# Altium schematic sheet OMD_UWB.SchDoc
size A4; Organization: Altium Limited; Address1: L3, 12a Rodborough Rd; Address2: Frenchs Forest; Address3: NSW; Address4: Australia 2086
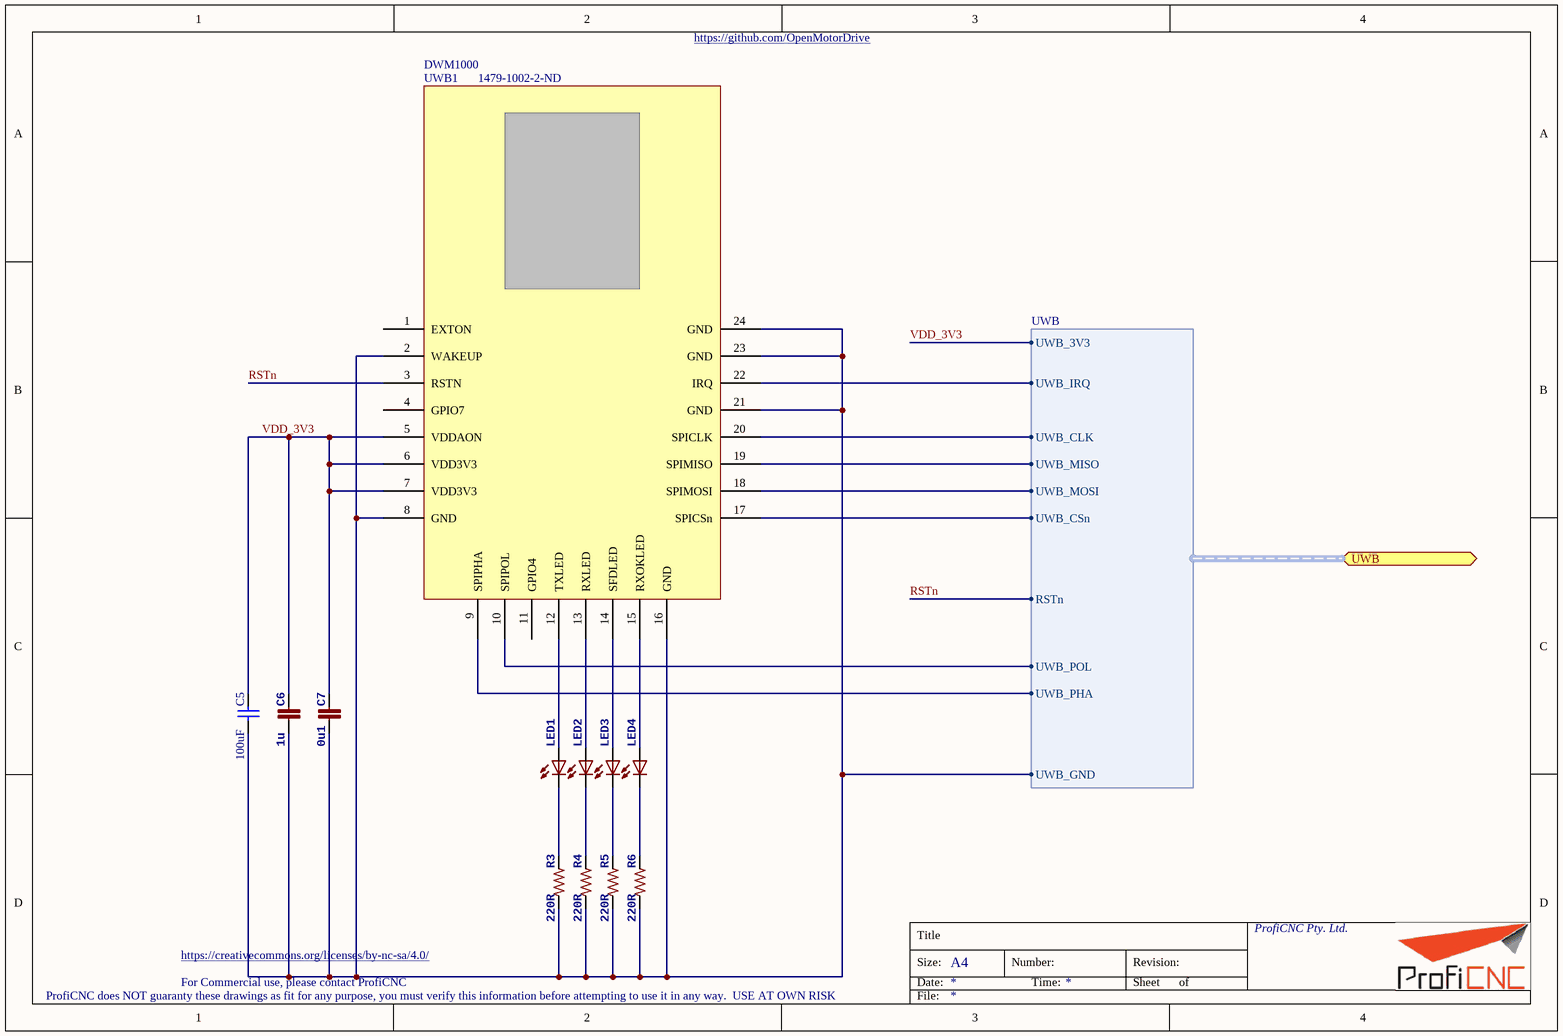
[diagram p0: OMD_UWB.SchDoc]

## Parts
C5  value 100uF  [C0805]  (hidden comment: GRM21BR60G107ME15L)
C6  1u  [0201-cap]
C7  0u1  [0201-cap]
LED1  AMBER  [0603-LED]  (value not drawn)
LED2  AMBER  [0603-LED]  (value not drawn)
LED3  AMBER  [0603-LED]  (value not drawn)
LED4  AMBER  [0603-LED]  (value not drawn)
R3  220R  [0402-RES]
R4  220R  [0402-RES]
R5  220R  [0402-RES]
R6  220R  [0402-RES]
UWB1  DWM1000  Supplier Part Number 1: 1479-1002-2-ND  [DWM1000]

## Ports
UWB (harness UWB)

## Harnesses
UWB: UWB_IRQ, UWB_CLK, UWB_MISO, UWB_MOSI, UWB_CSn, UWB_POL, UWB_PHA, UWB_GND, UWB_3V3, RSTn

## Nets
RSTn: UWB1.3(RSTN) ; port UWB.RSTn
VDD_3V3: C5.2 C6.1 C7.1 UWB1.5(VDDAON) UWB1.6(VDD3V3) UWB1.7(VDD3V3) ; port UWB.UWB_3V3
NetC5_1: C5.1 C6.2 C7.2 R3.1 R4.1 R5.1 R6.1 UWB1.2(WAKEUP) UWB1.8(GND) UWB1.16(GND) UWB1.21(GND) UWB1.23(GND) UWB1.24(GND) ; port UWB.UWB_GND
NetLED1_A: LED1.A UWB1.12(TXLED)
NetLED1_C: LED1.C R3.2
NetLED2_A: LED2.A UWB1.13(RXLED)
NetLED2_C: LED2.C R4.2
NetLED3_A: LED3.A UWB1.14(SFDLED)
NetLED3_C: LED3.C R5.2
NetLED4_A: LED4.A UWB1.15(RXOKLED)
NetLED4_C: LED4.C R6.2
NetUWB1_9: UWB1.9(SPIPHA) ; port UWB.UWB_PHA
NetUWB1_10: UWB1.10(SPIPOL) ; port UWB.UWB_POL
NetUWB1_17: UWB1.17(SPICSn) ; port UWB.UWB_CSn
NetUWB1_18: UWB1.18(SPIMOSI) ; port UWB.UWB_MOSI
NetUWB1_19: UWB1.19(SPIMISO) ; port UWB.UWB_MISO
NetUWB1_20: UWB1.20(SPICLK) ; port UWB.UWB_CLK
NetUWB1_22: UWB1.22(IRQ) ; port UWB.UWB_IRQ

Not connected (* = marked no-connect by the designer): UWB1 1(EXTON) 4(GPIO7) 11(GPIO4)

## Notes on the sheet
- https://github.com/OpenMotorDrive
- https://creativecommons.org/licenses/by-nc-sa/4.0/
- For Commercial use, please contact ProfiCNC
- Title
- Size:
- Date:
- A4
- Number:
- Time:
- Revision:
- Sheet
- of
- ProfiCNC Pty. Ltd.
- ProfiCNC does NOT guaranty these drawings as fit for any purpose, you must verify this information before attempting to use it in any way.  USE AT OWN RISK
- File:

## Library data of the parts
C5 = Capacitor: Supplier 1: Digi-Key; Supplier Part Number 1: 490-10510-1-ND
C6 = CAP0603: CAP CER 1UF 6.3V X5R 0201; Supplier 1: Digi-Key; Supplier Part Number 1: 490-7229-2-ND
C7 = CAP0402: CAP CER 0.1UF 16V Y5V 0402; Supplier 1: Digi-Key; Supplier Part Number 1: 490-10404-2-ND
LED1-LED4 = LED0603: LED 1.6X0.8 DOME ORN CLEAR SMD; Supplier 1: Digi-Key; Supplier Part Number 1: 754-1802-1-ND; Value: AMBER
R3-R6 = RESISTOR0402-RES: RES 220 OHM 1/16W 1% 0402 SMD; Supplier 1: Digi-Key; Supplier Part Number 1: 311-220LRCT-ND; Value: 220R
UWB1 = DWM1000: Supplier 1: Digi-Key